# EAGLE schematic harp syringe pump v1.1 (EAGLE 9.6.2)

## Sheet 1 of 3
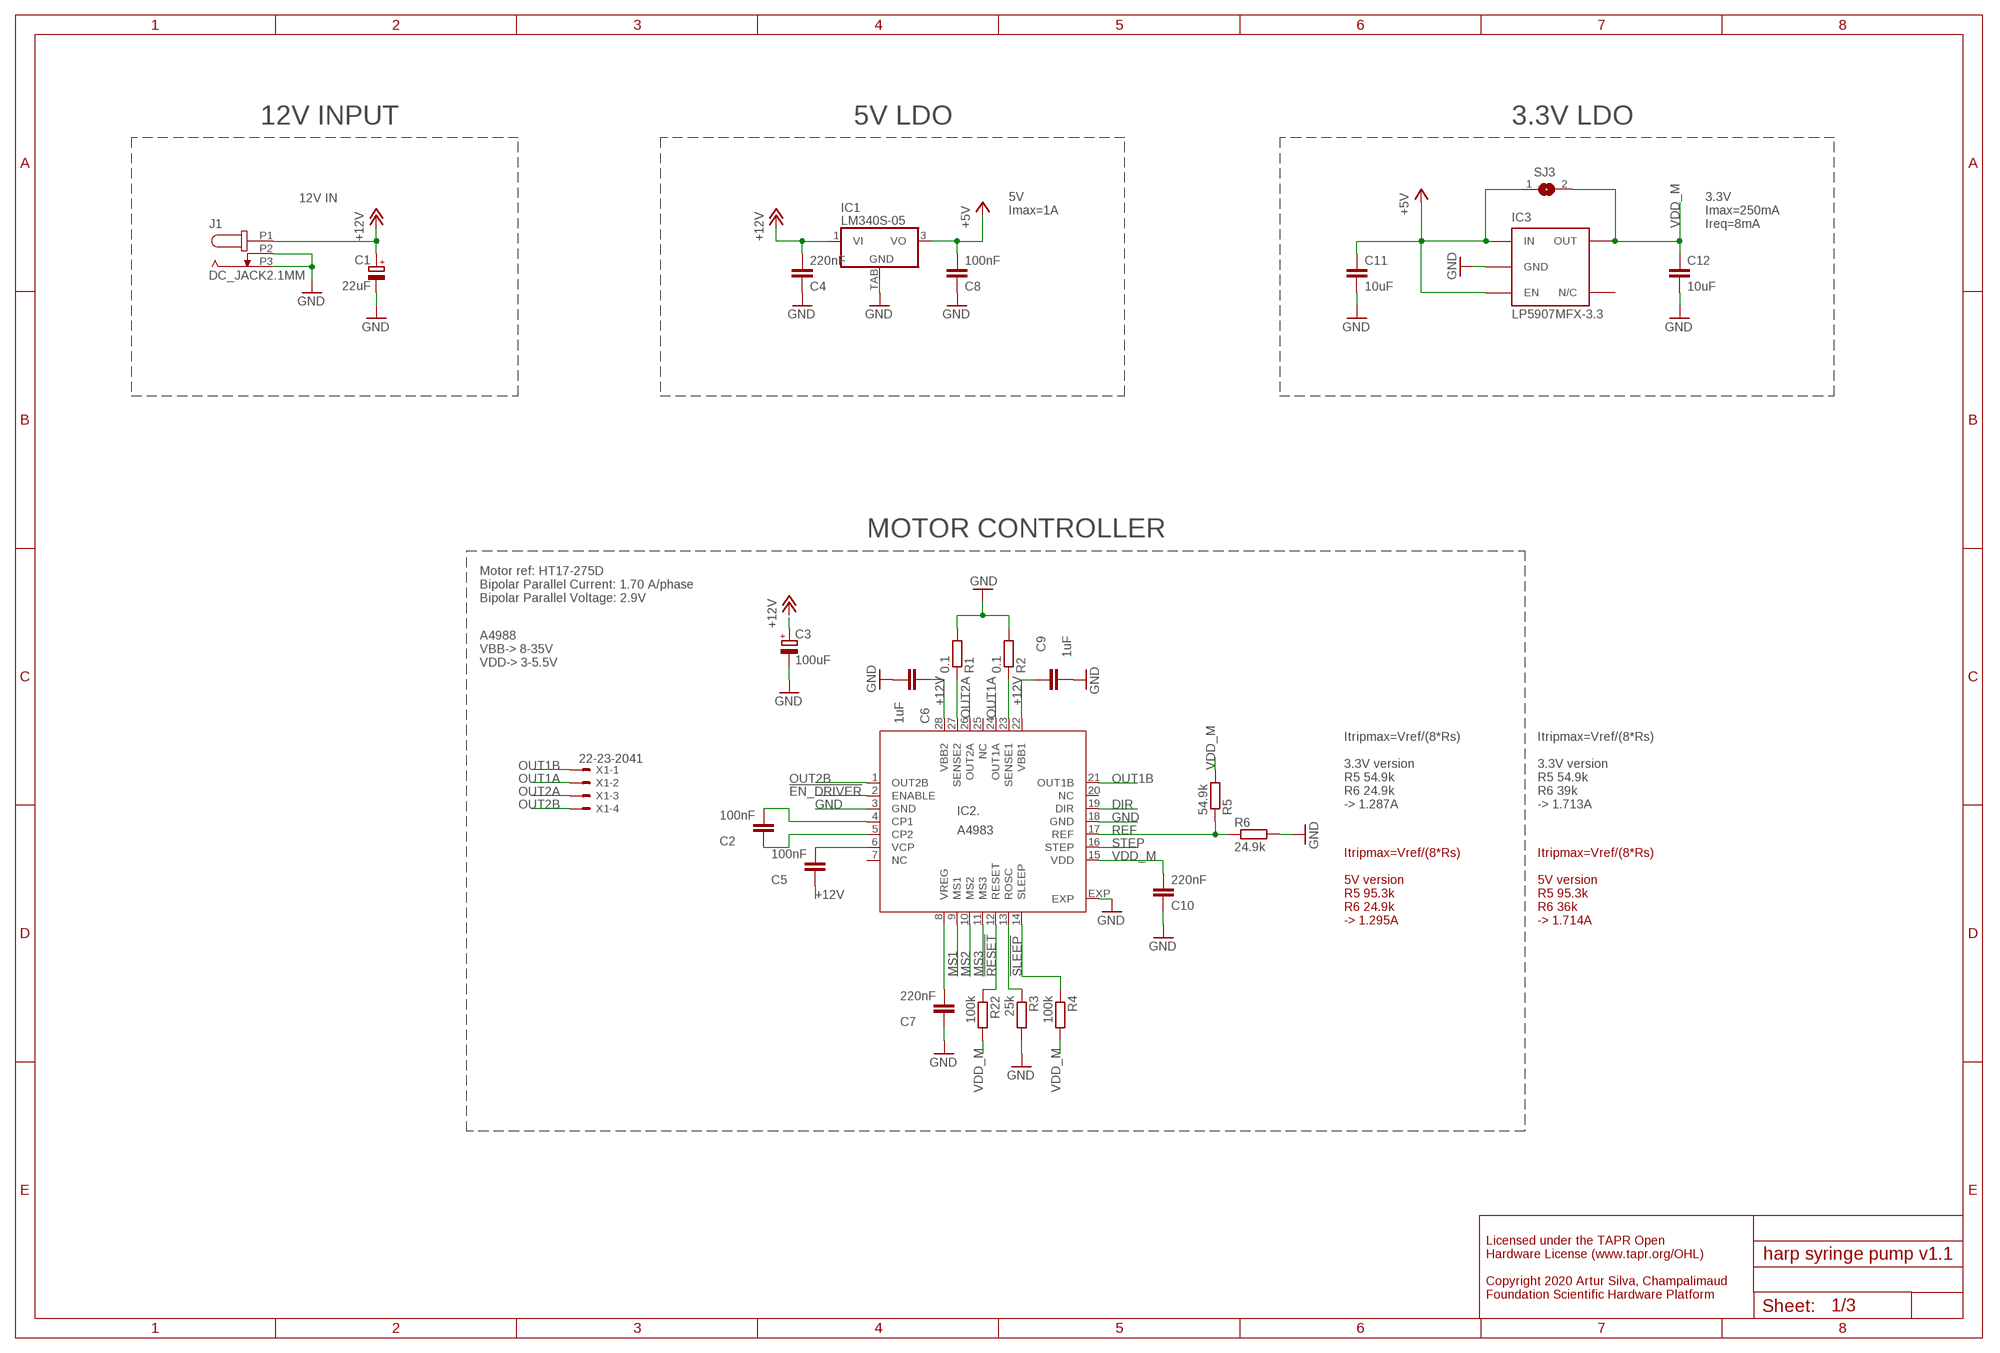
[diagram p0: schematic, sheet 1]

### Parts
C1  22uF  CAP_100UFHAND  [CAP_100UF_HAND]
C2  100nF  C-EUC0603  [C0603]
C3  100uF  CPOL-EUE  [PANASONIC_E]
C4  220nF  C-EUC0603  [C0603]
C5  100nF  C-EUC0603  [C0603]
C6  1uF  C-EUC0603  [C0603]
C7  220nF  C-EUC0603  [C0603]
C8  100nF  C-EUC0402  [C0402]
C9  1uF  C-EUC0603  [C0603]
C10  220nF  C-EUC0603  [C0603]
C11  10uF  C-EUC0603  [C0603]
C12  10uF  C-EUC0603  [C0603]
IC1  LM340S-05  [TO263-3]
IC2.  A4983  [QFN28ET]
IC3  LP5907MFX-3.3  TLV700XX  [TSOT23-5]
J1  DC_JACK2.1MM  [DC_POWER_INPUT_2.1MM]
R1  0.1  R-EU_R2010  [R2010]
R2  0.1  R-EU_R2010  [R2010]
R3  25k  R-EU_R0402  [R0402]
R4  100k  R-EU_R0402  [R0402]
R5  54.9k  R-EU_R0402  [R0402]
R6  24.9k  R-EU_R0402  [R0402]
R22  100k  R-EU_R0402  [R0402]
SJ3  SJ  [SJ]
X1  22-23-2041  [22-23-2041]

### Nets
!EN_DRIVER: IC2..2(ENABLE) ; also sheet 2
!RESET: IC2..12(RESET) R22.1 ; also sheet 2
!SLEEP: IC2..14(SLEEP) R4.1 ; also sheet 2
+5V: C8.2 C11.1 IC1.3(VO) IC3.1(IN) IC3.3(EN) SJ3.1 ; also sheet 2
+12V: C1.+ C3.+ C4.2 C5.1 C6.1 C9.1 IC1.1(VI) IC2..22(VBB1) IC2..28(VBB2) J1.P1
CP1: C2.2 IC2..4(CP1)
CP2: C2.1 IC2..5(CP2)
DIR: IC2..19(DIR) ; also sheet 2
GND: C1.- C3.- C4.1 C6.2 C7.1 C8.1 C9.2 C10.1 C11.2 C12.2 IC1.TAB(GND) IC2..3(GND) IC2..18(GND) IC2..EXP IC3.2(GND) J1.P2 J1.P3 R1.2 R2.2 R3.2 R6.2 ; also sheet 2,3
MS1: IC2..9(MS1) ; also sheet 2
MS2: IC2..10(MS2) ; also sheet 2
MS3: IC2..11(MS3) ; also sheet 2
N$4: C7.2 IC2..8(VREG)
N$6: IC2..13(ROSC) R3.1
OUT1A: IC2..24(OUT1A) X1.2
OUT1B: IC2..21(OUT1B) X1.1
OUT2A: IC2..26(OUT2A) X1.3
OUT2B: IC2..1(OUT2B) X1.4
REF: IC2..17(REF) R5.1 R6.1
SENSE1: IC2..23(SENSE1) R2.1
SENSE2: IC2..27(SENSE2) R1.1
STEP: IC2..16(STEP) ; also sheet 2
VCP: C5.2 IC2..6(VCP)
VDD_M: C10.2 C12.1 IC2..15(VDD) IC3.5(OUT) R4.2 R5.2 R22.2 SJ3.2
Unconnected: IC2..7(NC) IC2..20(NC) IC2..25(NC) IC3.4(N/C)

### Notes on the sheet
- 12V INPUT | 5V LDO | 3.3V LDO
- 12V IN
- 5V
  Imax=1A
- 3.3V
  Imax=250mA
  Ireq=8mA
- MOTOR CONTROLLER
- Motor ref: HT17-275D
  Bipolar Parallel Current: 1.70 A/phase
  Bipolar Parallel Voltage: 2.9V
- A4988
  VBB-> 8-35V
  VDD-> 3-5.5V
- Itripmax=Vref/(8*Rs)
  
  3.3V version
  R5 54.9k
  R6 24.9k
  -> 1.287A
- Itripmax=Vref/(8*Rs)
  
  3.3V version
  R5 54.9k
  R6 39k 
  -> 1.713A
- Itripmax=Vref/(8*Rs)
  
  5V version
  R5 95.3k
  R6 24.9k
  -> 1.295A
- Itripmax=Vref/(8*Rs)
  
  5V version
  R5 95.3k
  R6 36k 
  -> 1.714A
- Licensed under the TAPR Open
  Hardware License (www.tapr.org/OHL)
  
  Copyright 2020 Artur Silva, Champalimaud
  Foundation Scientific Hardware Platform

## Sheet 2 of 3
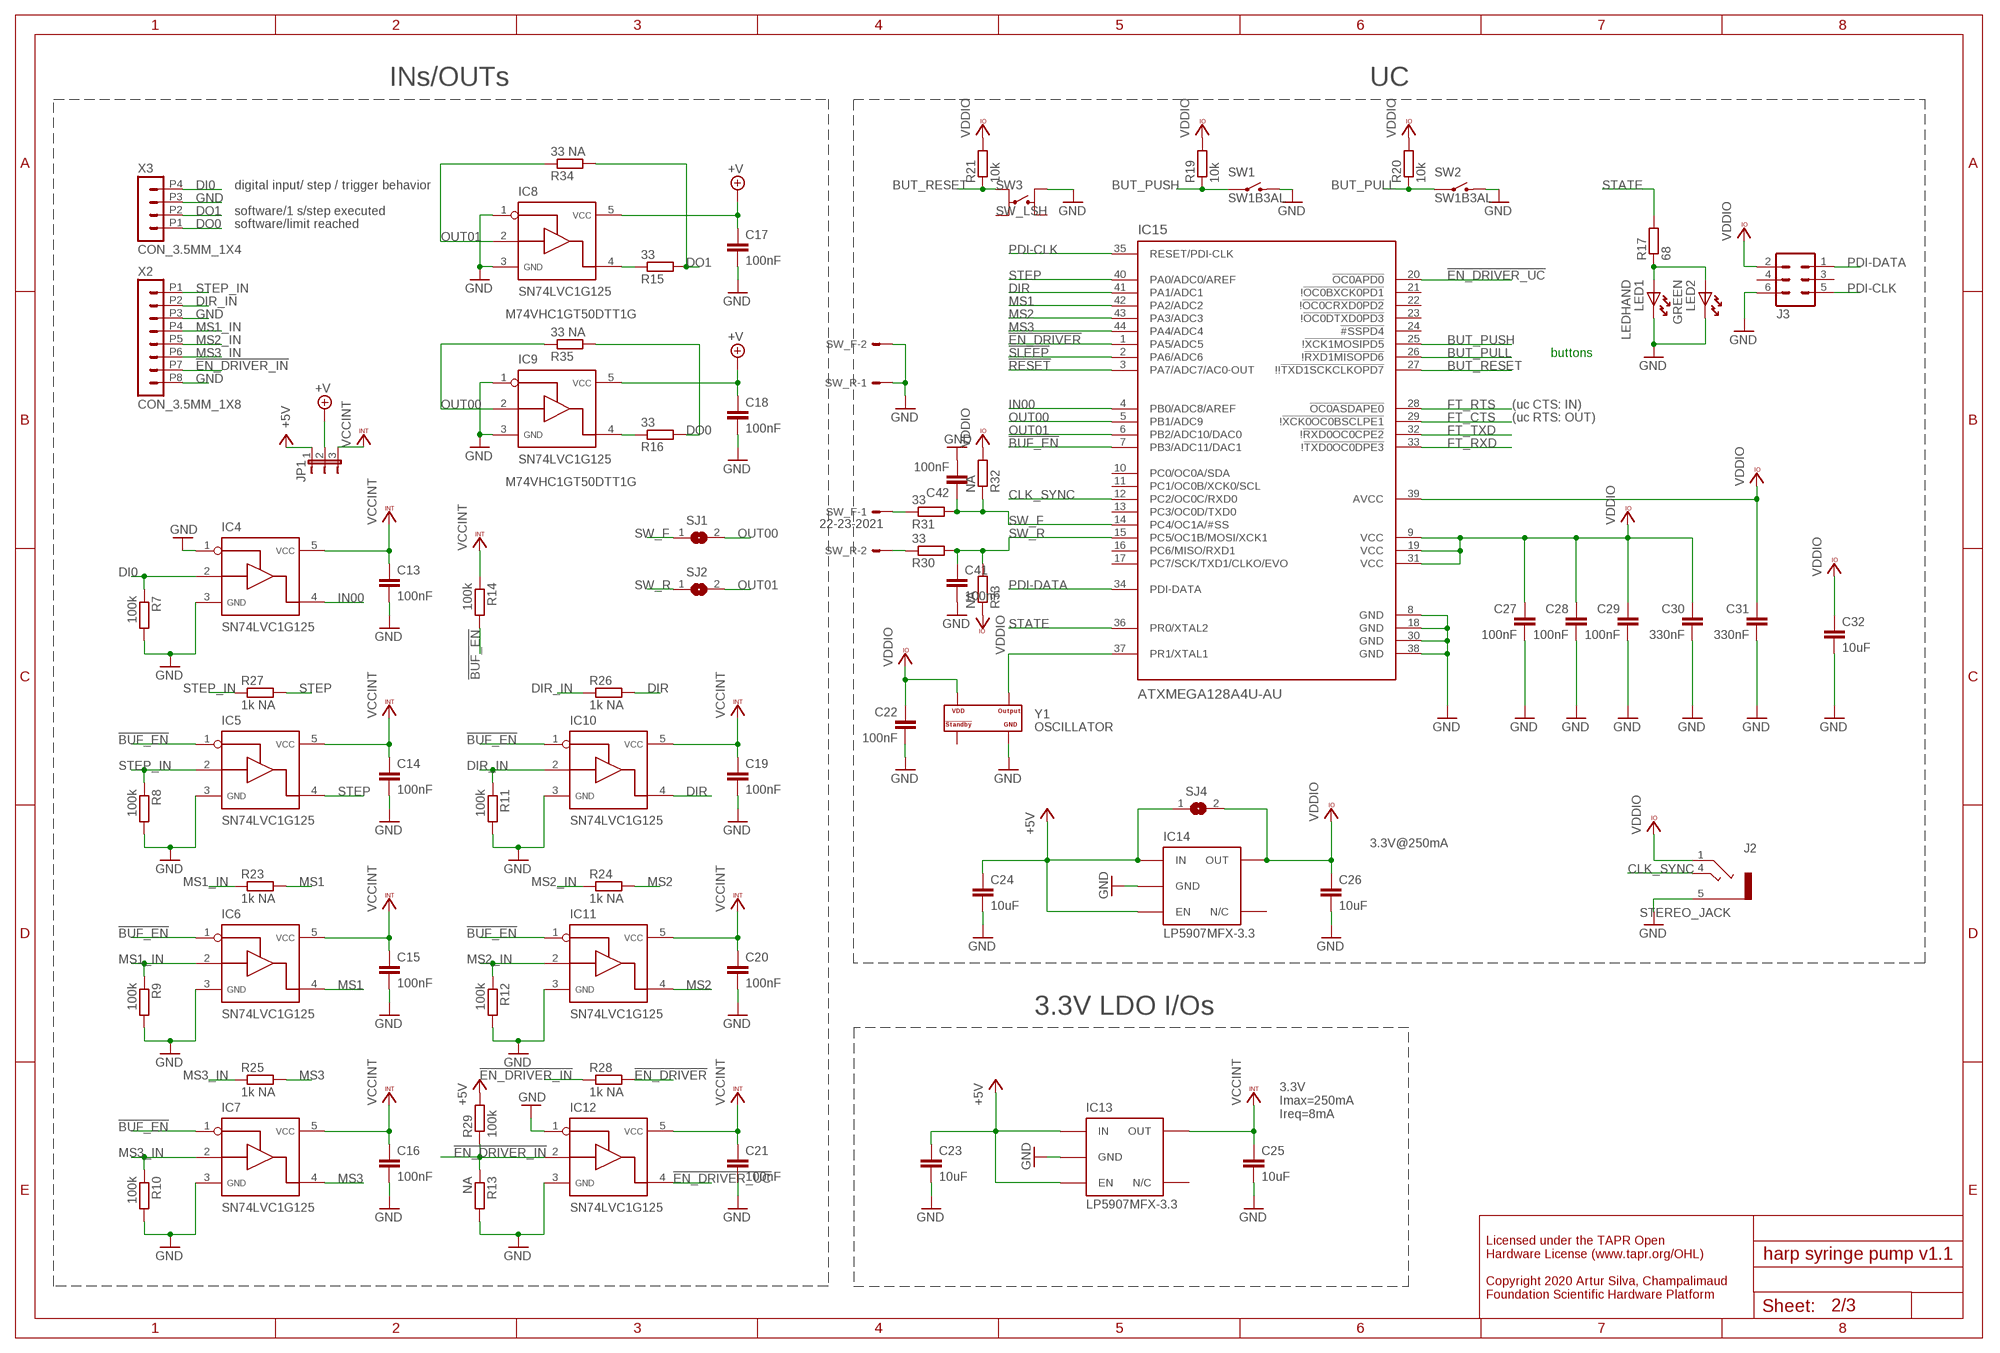
[diagram p1: schematic, sheet 2]

### Parts
C13  100nF  C-EUC0402  [C0402]
C14  100nF  C-EUC0402  [C0402]
C15  100nF  C-EUC0402  [C0402]
C16  100nF  C-EUC0402  [C0402]
C17  100nF  C-EUC0402  [C0402]
C18  100nF  C-EUC0402  [C0402]
C19  100nF  C-EUC0402  [C0402]
C20  100nF  C-EUC0402  [C0402]
C21  100nF  C-EUC0402  [C0402]
C22  100nF  C-EUC0402  [C0402]
C23  10uF  C-EUC0603  [C0603]
C24  10uF  C-EUC0603  [C0603]
C25  10uF  C-EUC0603  [C0603]
C26  10uF  C-EUC0603  [C0603]
C27  100nF  C-EUC0402  [C0402]
C28  100nF  C-EUC0402  [C0402]
C29  100nF  C-EUC0402  [C0402]
C30  330nF  C-EUC0402  [C0402]
C31  330nF  C-EUC0402  [C0402]
C32  10uF  C-EUC0603  [C0603]
C41  100nF  C-EUC0402  [C0402]
C42  100nF  C-EUC0402  [C0402]
IC4  SN74LVC1G125  [SOT23-5]
IC5  SN74LVC1G125  [SOT23-5]
IC6  SN74LVC1G125  [SOT23-5]
IC7  SN74LVC1G125  [SOT23-5]
IC8  SN74LVC1G125  [SOT23-5]
IC9  SN74LVC1G125  [SOT23-5]
IC10  SN74LVC1G125  [SOT23-5]
IC11  SN74LVC1G125  [SOT23-5]
IC12  SN74LVC1G125  [SOT23-5]
IC13  LP5907MFX-3.3  TLV700XX  [TSOT23-5]
IC14  LP5907MFX-3.3  TLV700XX  [TSOT23-5]
IC15  ATXMEGA128A4U-AU  AT-XMEGA-XXA4-AU  [QFP80P1200X1200X120-44N]
J2  STEREO_JACK  [35RASMT2BHNTRX]
J3  MA03-2  [MA03-2]
JP1  JP2E  [JP2]
LED1  LEDHAND  [LED_HAND]
LED2  GREEN  LEDHAND  [LED_HAND]
R7  100k  R-EU_R0402  [R0402]
R8  100k  R-EU_R0402  [R0402]
R9  100k  R-EU_R0402  [R0402]
R10  100k  R-EU_R0402  [R0402]
R11  100k  R-EU_R0402  [R0402]
R12  100k  R-EU_R0402  [R0402]
R13  NA  R-EU_R0402  [R0402]
R14  100k  R-EU_R0402  [R0402]
R15  33  R-EU_R0402  [R0402]
R16  33  R-EU_R0402  [R0402]
R17  68  R-EU_R0402  [R0402]
R19  10k  R-EU_R0402  [R0402]
R20  10k  R-EU_R0402  [R0402]
R21  10k  R-EU_R0402  [R0402]
R23  1k NA  R-EU_R0402  [R0402]
R24  1k NA  R-EU_R0402  [R0402]
R25  1k NA  R-EU_R0402  [R0402]
R26  1k NA  R-EU_R0402  [R0402]
R27  1k NA  R-EU_R0402  [R0402]
R28  1k NA  R-EU_R0402  [R0402]
R29  100k  R-EU_R0402  [R0402]
R30  33  R-EU_R0402  [R0402]
R31  33  R-EU_R0402  [R0402]
R32  NA  R-EU_R0402  [R0402]
R33  NA  R-EU_R0402  [R0402]
R34  33 NA  R-EU_R0402  [R0402]
R35  33 NA  R-EU_R0402  [R0402]
SJ1  SJ  [SJ]
SJ2  SJ  [SJ]
SJ4  SJ  [SJ]
SW1  SW1B3AL  [SW_B3AL]
SW2  SW1B3AL  [SW_B3AL]
SW3  SW_LSH  [SWITCH_LSH]
SW_F  22-23-2021  [22-23-2021]
SW_R  22-23-2021  [22-23-2021]
X2  CON_3.5MM_1X8  [CON_3.5MM_1X8]
X3  CON_3.5MM_1X4  [CON_3.5MM_1X4]
Y1  OSCILLATOR  [OSCILLATOR_3.2X2.5]

### Nets
!BUF_EN: IC5.1 IC6.1 IC7.1 IC10.1 IC11.1 IC15.7(PB3/ADC11/DAC1) R14.2
!EN_DRIVER: IC15.1(PA5/ADC5) R28.2 ; also sheet 1
!EN_DRIVER_IN: IC12.2 R13.1 R28.1 R29.1 X2.P7
!EN_DRIVER_UC: IC12.4 IC15.20(!OC0APD0)
!RESET: IC15.3(PA7/ADC7/AC0-OUT) ; also sheet 1
!SLEEP: IC15.2(PA6/ADC6) ; also sheet 1
+5V: C23.1 C24.1 IC13.1(IN) IC13.3(EN) IC14.1(IN) IC14.3(EN) JP1.1 R29.2 SJ4.1 ; also sheet 1
+V: C17.1 C18.1 IC8.5 IC9.5 JP1.2
BUT_PULL: IC15.26(!!RXD1MISOPD6) R20.1 SW2.P
BUT_PUSH: IC15.25(!!XCK1MOSIPD5) R19.1 SW1.P
BUT_RESET: IC15.27(!!!TXD1SCKCLKOPD7) R21.1 SW3.P0(P)
CLK_SYNC: IC15.12(PC2/OC0C/RXD0) J2.4
DI0: IC4.2 R7.1 X3.P4
DIR: IC10.4 IC15.41(PA1/ADC1) R26.2 ; also sheet 1
DIR_IN: IC10.2 R11.1 R26.1 X2.P2
DO0: R16.2 R35.2 X3.P1
DO1: R15.2 R34.2 X3.P2
FT_CTS: IC15.29(!!XCK0OC0BSCLPE1) ; also sheet 3
FT_RTS: IC15.28(!OC0ASDAPE0) ; also sheet 3
FT_RXD: IC15.33(!!TXD0OC0DPE3) ; also sheet 3
FT_TXD: IC15.32(!!RXD0OC0CPE2) ; also sheet 3
GND: C13.2 C14.2 C15.2 C16.2 C17.2 C18.2 C19.2 C20.2 C21.2 C22.2 C23.2 C24.2 C25.2 C26.2 C27.2 C28.2 C29.2 C30.2 C31.2 C32.2 C41.2 C42.2 IC4.1 IC4.3 IC5.3 IC6.3 IC7.3 IC8.1 IC8.3 IC9.1 IC9.3 IC10.3 IC11.3 IC12.1 IC12.3 IC13.2(GND) IC14.2(GND) IC15.8(GND) IC15.18(GND) IC15.30(GND) IC15.38(GND) J2.5 J3.6 LED1.K LED2.K R7.2 R8.2 R9.2 R10.2 R11.2 R12.2 R13.2 SW1.O SW2.O SW3.O0(O) SW_F.2 SW_R.1 X2.P3 X2.P8 X3.P3 Y1.P$2(GND) ; also sheet 1,3
IN00: IC4.4 IC15.4(PB0/ADC8/AREF)
MS1: IC6.4 IC15.42(PA2/ADC2) R23.2 ; also sheet 1
MS1_IN: IC6.2 R9.1 R23.1 X2.P4
MS2: IC11.4 IC15.43(PA3/ADC3) R24.2 ; also sheet 1
MS2_IN: IC11.2 R12.1 R24.1 X2.P5
MS3: IC7.4 IC15.44(PA4/ADC4) R25.2 ; also sheet 1
MS3_IN: IC7.2 R10.1 R25.1 X2.P6
N$1: IC8.4 R15.1
N$3: R30.1 SW_R.2
N$5: R31.1 SW_F.1
N$11: IC9.4 R16.1
N$23: LED1.A LED2.A R17.1
OSC1: IC15.37(PR1/XTAL1) Y1.P$3(OUTPUT)
OUT00: IC9.2 IC15.5(PB1/ADC9) R35.1 SJ1.2
OUT01: IC8.2 IC15.6(PB2/ADC10/DAC0) R34.1 SJ2.2
PDI-CLK: IC15.35(RESET/PDI-CLK) J3.5
PDI-DATA: IC15.34(PDI-DATA) J3.1
STATE: IC15.36(PR0/XTAL2) R17.2
STEP: IC5.4 IC15.40(PA0/ADC0/AREF) R27.2 ; also sheet 1
STEP_IN: IC5.2 R8.1 R27.1 X2.P1
SW_F: C42.1 IC15.14(PC4/OC1A/#SS) R31.2 R32.1 SJ1.1
SW_R: C41.1 IC15.15(PC5/OC1B/MOSI/XCK1) R30.2 R33.2 SJ2.1
VCCINT: C13.1 C14.1 C15.1 C16.1 C19.1 C20.1 C21.1 C25.1 IC4.5 IC5.5 IC6.5 IC7.5 IC10.5 IC11.5 IC12.5 IC13.5(OUT) JP1.3 R14.1
VCCIO: C22.1 C26.1 C27.1 C28.1 C29.1 C30.1 C31.1 C32.1 IC14.5(OUT) IC15.9(VCC) IC15.19(VCC) IC15.31(VCC) IC15.39(AVCC) J2.1 J3.2 R19.2 R20.2 R21.2 R32.2 R33.1 SJ4.2 Y1.P$4(VDD) ; supply symbol labelled VDDIO
Unconnected: IC13.4(N/C) IC14.4(N/C) IC15.10(PC0/OC0A/SDA) IC15.11(PC1/OC0B/XCK0/SCL) IC15.13(PC3/OC0D/TXD0) IC15.16(PC6/MISO/RXD1) IC15.17(PC7/SCK/TXD1/CLKO/EVO) IC15.21(!!OC0BXCK0PD1) IC15.22(!!OC0CRXD0PD2) IC15.23(!!OC0DTXD0PD3) IC15.24(!#SSPD4) J3.3 J3.4 SW3.O1 SW3.P1 Y1.P$1(STANDBY#)

### Notes on the sheet
- INs/OUTs | UC
- digital input/ step / trigger behavior
- software/1 s/step executed
- software/limit reached
- M74VHC1GT50DTT1G
- buttons
- (uc CTS: IN)
- (uc RTS: OUT)
- M74VHC1GT50DTT1G
- 3.3V@250mA
- 3.3V LDO I/Os
- 3.3V
  Imax=250mA
  Ireq=8mA
- Licensed under the TAPR Open
  Hardware License (www.tapr.org/OHL)
  
  Copyright 2020 Artur Silva, Champalimaud
  Foundation Scientific Hardware Platform

## Sheet 3 of 3
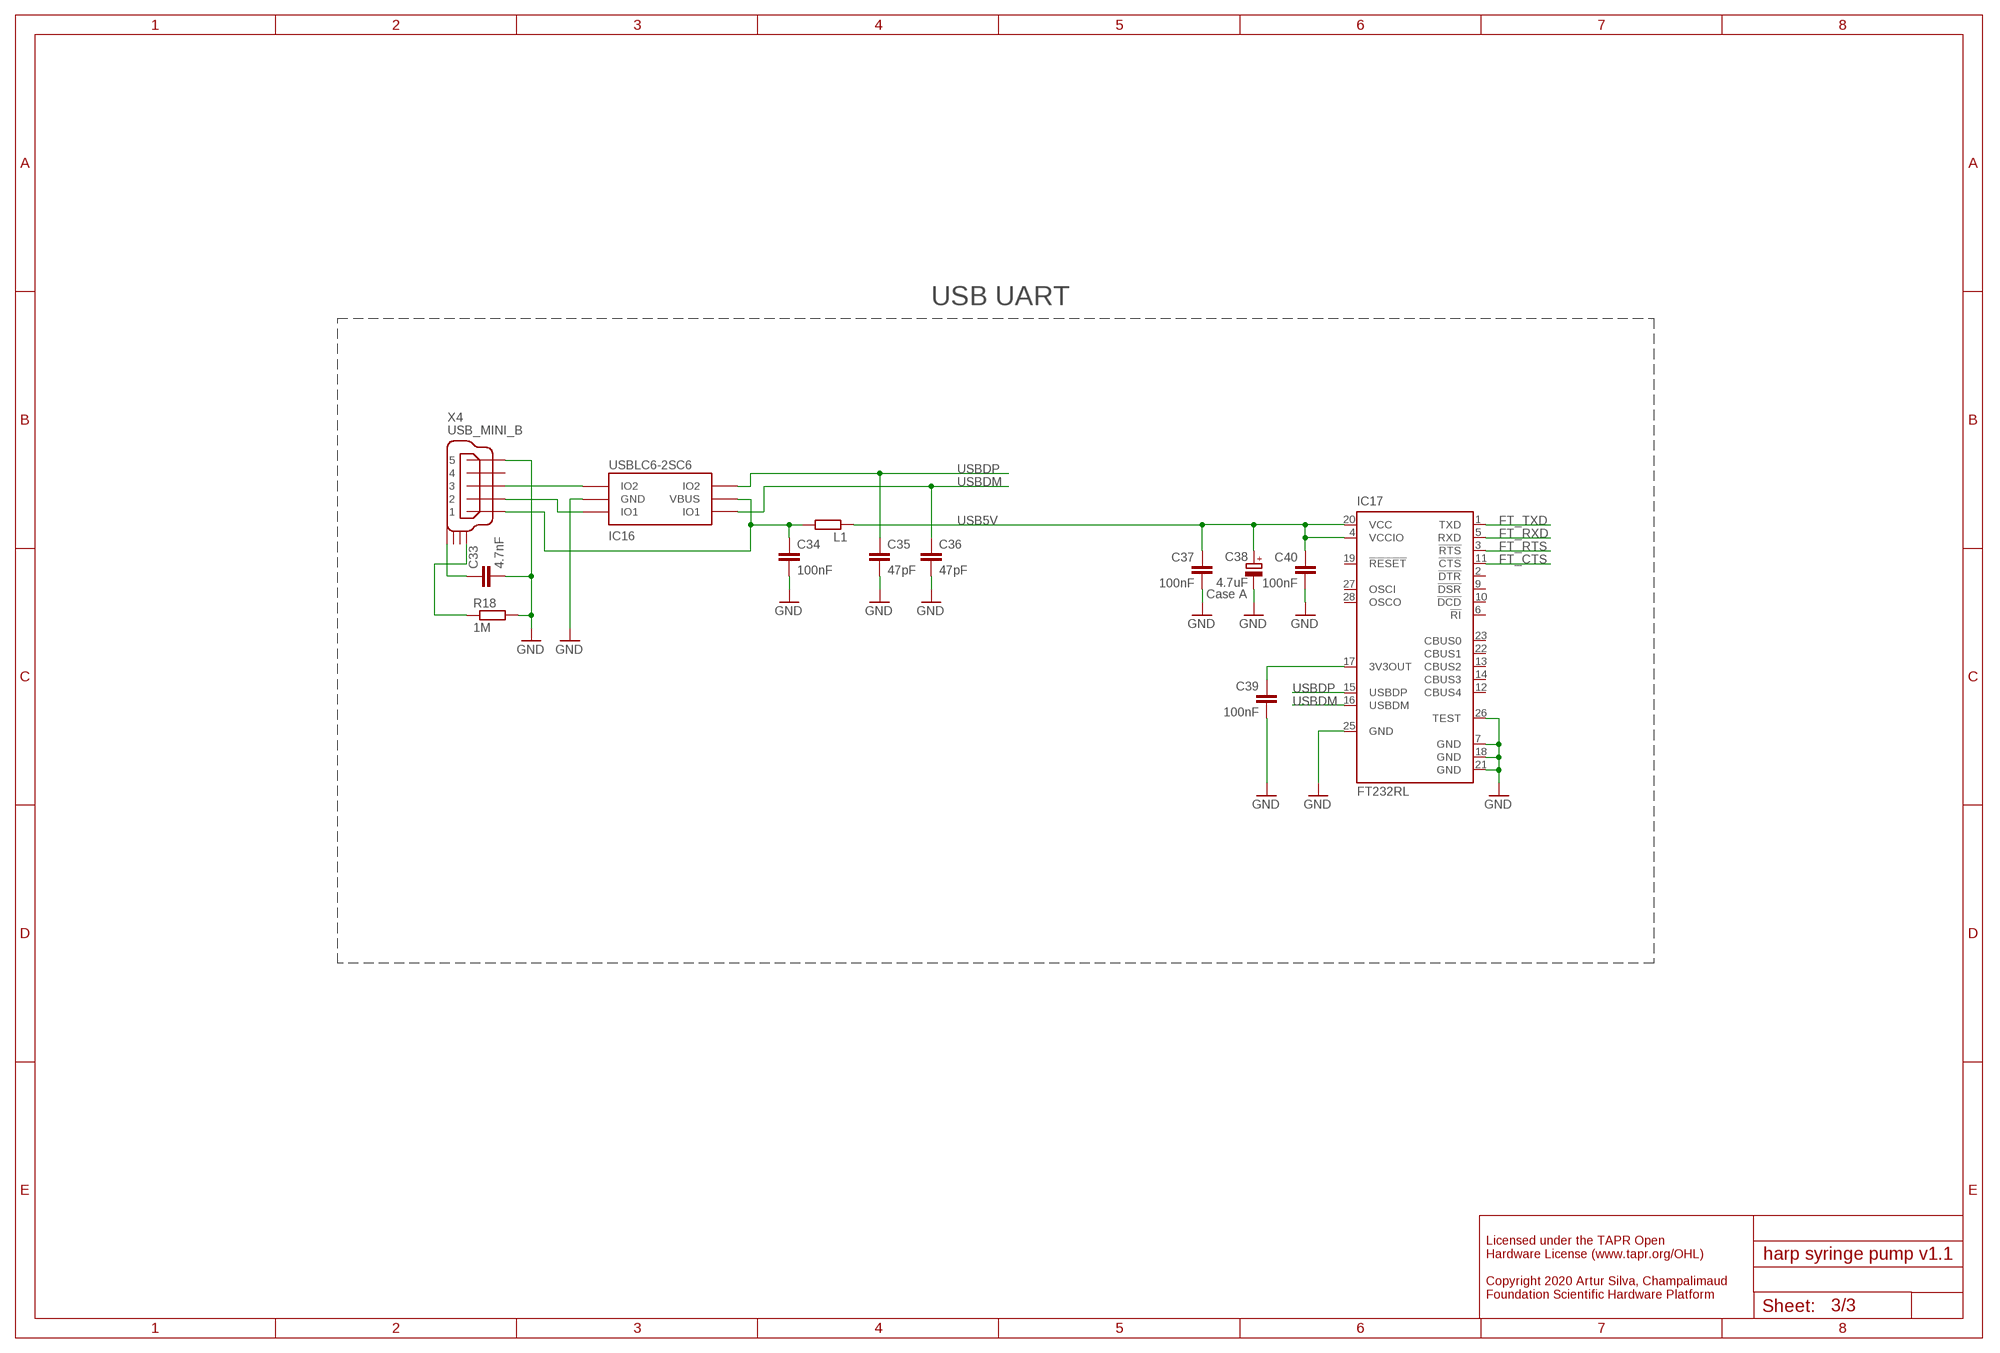
[diagram p2: schematic, sheet 3]

### Parts
C33  4.7nF  C-EUC0402  [C0402]
C34  100nF  C-EUC0402  [C0402]
C35  47pF  C-EUC0402  [C0402]
C36  47pF  C-EUC0402  [C0402]
C37  100nF  C-EUC0402  [C0402]
C38  4.7uF  CPOL-EUA/3216-18W  [A/3216-18W]
C39  100nF  C-EUC0402  [C0402]
C40  100nF  C-EUC0402  [C0402]
IC16  USBLC6-2SC6  USBLC6-2  [SOT23-6L]
IC17  FT232RL  [SSOP28]
L1  ???  R-EU_R0805  [R0805]
R18  1M  R-EU_R0402  [R0402]
X4  USB_MINI_B  [240-0002-1]

### Nets
3V3OUT: C39.1 IC17.17(3V3OUT)
FT_CTS: IC17.11(!CTS) ; also sheet 2
FT_RTS: IC17.3(!RTS) ; also sheet 2
FT_RXD: IC17.5(RXD) ; also sheet 2
FT_TXD: IC17.1(TXD) ; also sheet 2
GND: C33.2 C34.2 C35.2 C36.2 C37.2 C38.- C39.2 C40.2 IC16.P$2(GND) IC17.7(GND) IC17.18(GND) IC17.21(GND) IC17.25(GND) IC17.26(TEST) R18.2 X4.P$5 ; also sheet 1,2
N$13: IC16.P$3(IO2) X4.P$3
N$15: C33.1 X4.SHIELD_4
N$60: C34.1 IC16.P$5(VBUS) L1.2 X4.P$1
N$601: R18.1 X4.SHIELD_1
N$701: IC16.P$1(IO1) X4.P$2
USB5V: C37.1 C38.+ C40.1 IC17.4(VCCIO) IC17.20(VCC) L1.1
USBDM: C36.1 IC16.P$6(IO1) IC17.16(USBDM)
USBDP: C35.1 IC16.P$4(IO2) IC17.15(USBDP)
Unconnected: IC17.2(!DTR) IC17.6(!RI) IC17.9(!DSR) IC17.10(!DCD) IC17.12(CBUS4) IC17.13(CBUS2) IC17.14(CBUS3) IC17.19(!RESET) IC17.22(CBUS1) IC17.23(CBUS0) IC17.27(OSCI) IC17.28(OSCO) X4.P$4 X4.SHIELD_2 X4.SHIELD_3

### Notes on the sheet
- USB UART
- Case A
- Licensed under the TAPR Open
  Hardware License (www.tapr.org/OHL)
  
  Copyright 2020 Artur Silva, Champalimaud
  Foundation Scientific Hardware Platform

## Library data of the parts
C1 = CNP-miscellaneous:CAP_100UF
C2 C4-C37 C39-C42 = rcl:C-EU: CAPACITOR, European symbol; SPICEPREFIX: C
C3 C38 = rcl:CPOL-EU: POLARIZED CAPACITOR, European symbol; SPICEPREFIX: C
IC1 = linear:LM340?-*: Positive VOLTAGE REGULATOR Source: http://cache.national.com/ds/LM/LM340.pdf
IC2. = allegro:A4983: DMOS Microstepping Driver with Translator Auto generated by make-symbol-device-package-bsdl.ulp Rev. 32 Source: http://www.allegromicro.com/en/Products/Part_Numbers/4983/4983.pdf; MPN: A4983SETTR-T; OC_FARNELL: 1688956; OC_NEWARK: 39M6763
IC3 IC13 IC14 = CNP-ics 2:TLV700XX
IC4-IC9 IC11 IC12 = CNP-ics 1:SN74LVC1G125
IC10 = CNP-ics 1:SN74LVC1G125; SPICEPREFIX: IC
IC15 = xmega-a4:AT-XMEGA-XXA4-AU: ATxMega a4 Serie
IC16 = CNP-ics 1:USBLC6-2
IC17 = ftdichip:FT232R: Source: http://www.ftdichip.com/Documents/DataSheets/DS_FT232R_v104.pdf; MPN: FT232RL; OC_FARNELL: 1146032; OC_NEWARK: 91K9918
J1 = CNP-miscellaneous:DC_JACK
J2 = CNP-connectors:STEREO_JACK
J3 = con-lstb:MA03-2: PIN HEADER; OC_FARNELL: unknown; OC_NEWARK: unknown
JP1 = jumper:JP2E: JUMPER
L1 R1-R35 = rcl:R-EU_: RESISTOR, European symbol; SPICEPREFIX: R
LED1 LED2 = CNP-miscellaneous:LED
SJ1-SJ4 = jumper:SJ: SMD solder JUMPER
SW1 SW2 = CNP-miscellaneous:SW1
SW3 = CNP-miscellaneous:SW_LSH
SW_F SW_R = con-molex:22-23-2021: .100" (2.54mm) Center Header - 2 Pin; MF: MOLEX; MPN: 22-23-2021; OC_FARNELL: 1462926; OC_NEWARK: 25C3832
X1 = con-molex:22-23-2041: .100" (2.54mm) Center Header - 4 Pin; MF: MOLEX; MPN: 22-23-2041; OC_FARNELL: 1462920; OC_NEWARK: 38C0355
X2 = CNP-connectors:CON_3.5MM_1X8
X3 = CNP-connectors:CON_3.5MM_1X4
X4 = CNP-connectors:USB_MINI_B
Y1 = CNP-miscellaneous:OSCILLATOR